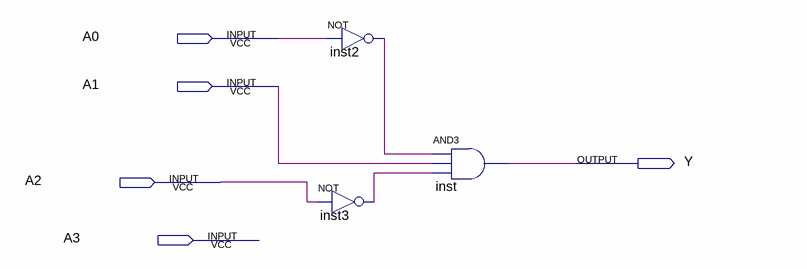
[diagram p0: schematic sheet]
// Quartus schematic Segment2.bdf as structural Verilog: 3 symbols, 5 pins
module Segment2 (
  input  A0,
  input  A1,
  input  A2,
  input  A3,
  output Y
);

  wire inst2_out, inst3_out;

  not inst2 (inst2_out, A0);
  not inst3 (inst3_out, A2);
  and inst (Y, inst2_out, A1, inst3_out);
endmodule
